# Altium schematic sheet esc_servo.SchDoc
size A4
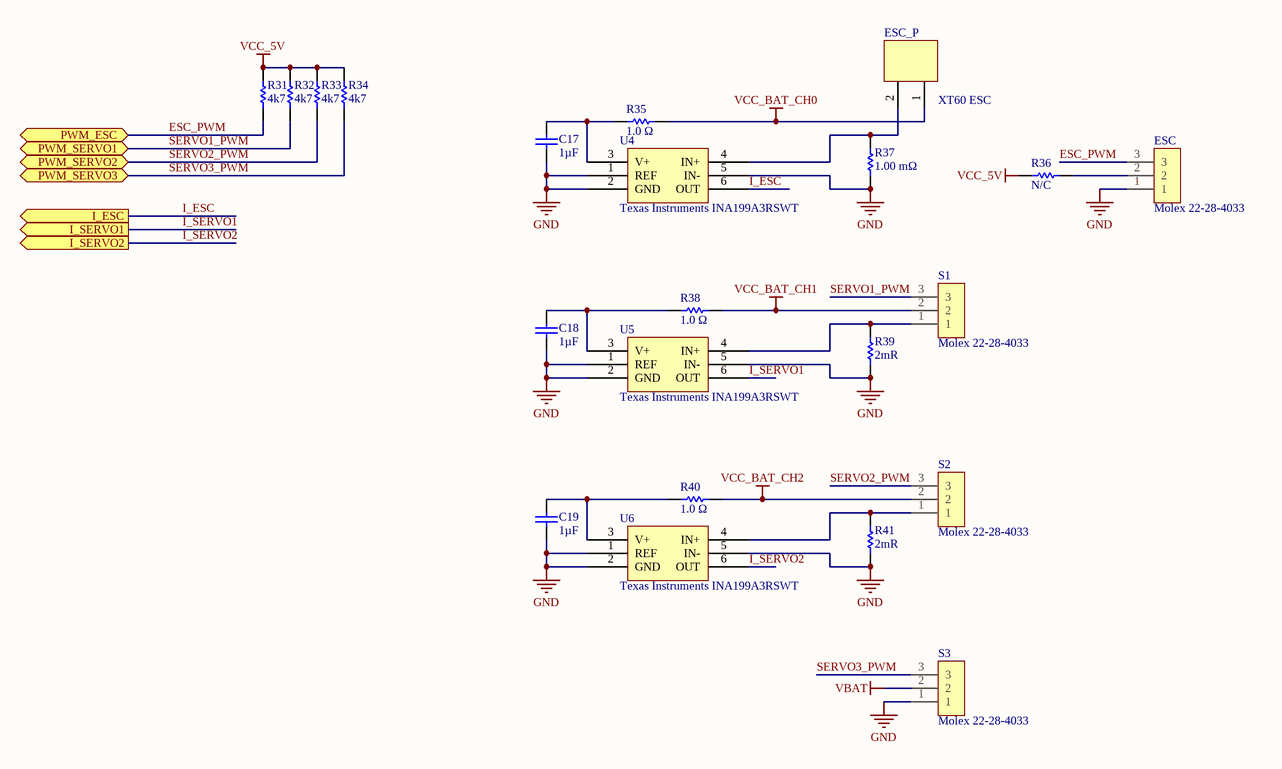
[diagram p0: esc_servo.SchDoc]

## Parts
C17  1µF  [CAPC1608X90X35LL15T15]
C18  1µF  [CAPC1608X90X35LL15T15]
C19  1µF  [CAPC1608X90X35LL15T15]
ESC  Molex 22-28-4033  [PCB-8kup8qw5vsmkearo8v0b-1]
ESC_P  XT60 ESC  [PCB-8tmbcd94dx0l5ponnqur-1]
R31  4k7  [RESC1608X55X30NL15T15]
R32  4k7  [RESC1608X55X30NL15T15]
R33  4k7  [RESC1608X55X30NL15T15]
R34  4k7  [RESC1608X55X30NL15T15]
R35  1.0 Ω  [RESC1609X50X30LL10T20]
R36  N/C  [RESC1608X55X25LL10T15]
R37  1.00 mΩ  [PCB-wws5gc0zzodyoofoa1sn-1]
R38  1.0 Ω  [RESC1609X50X30LL10T20]
R39  2mR  [RESC3216X89X51ML25T25]
R40  1.0 Ω  [RESC1609X50X30LL10T20]
R41  2mR  [RESC3216X89X51ML25T25]
S1  Molex 22-28-4033  [PCB-8kup8qw5vsmkearo8v0b-1]
S2  Molex 22-28-4033  [PCB-8kup8qw5vsmkearo8v0b-1]
S3  Molex 22-28-4033  [PCB-8kup8qw5vsmkearo8v0b-1]
U4  Texas Instruments INA199A3RSWT  [PCB-dzg43p1s5wcf61j10amz-1]
U5  Texas Instruments INA199A3RSWT  [PCB-dzg43p1s5wcf61j10amz-1]
U6  Texas Instruments INA199A3RSWT  [PCB-dzg43p1s5wcf61j10amz-1]

## Ports
I_ESC (out), I_SERVO1 (out), I_SERVO2 (out), PWM_ESC, PWM_SERVO1, PWM_SERVO2, PWM_SERVO3

## Nets
GND: C17.2 C18.2 C19.2 ESC.1 R37.1 R39.1 R41.1 S3.1 U4.1(REF) U4.2(GND) U4.5(IN-) U5.1(REF) U5.2(GND) U5.5(IN-) U6.1(REF) U6.2(GND) U6.5(IN-)
VBAT: S3.2
VCC_5V: R31.2 R32.2 R33.2 R34.2 R36.2
VCC_BAT_CH0: ESC_P.1 R35.2
VCC_BAT_CH1: R38.2 S1.2
VCC_BAT_CH2: R40.2 S2.2
ESC_PWM: ESC.3 R31.1 ; port PWM_ESC
I_ESC: U4.6(OUT) ; port I_ESC
I_SERVO1: U5.6(OUT) ; port I_SERVO1
I_SERVO2: U6.6(OUT) ; port I_SERVO2
SERVO1_PWM: R32.1 S1.3 ; port PWM_SERVO1
SERVO2_PWM: R33.1 S2.3 ; port PWM_SERVO2
SERVO3_PWM: R34.1 S3.3 ; port PWM_SERVO3
NetC17_1: C17.1 R35.1 U4.3(V+)
NetC18_1: C18.1 R38.1 U5.3(V+)
NetC19_1: C19.1 R40.1 U6.3(V+)
NetESC_2: ESC.2 R36.1
NetESC_P_2: ESC_P.2 R37.2 U4.4(IN+)
NetR39_2: R39.2 S1.1 U5.4(IN+)
NetR41_2: R41.2 S2.1 U6.4(IN+)

## Library data of the parts
C17-C19 = CMP-f2f83b8d074c2d3f-6: 0603 1 uF 16 V ±10 % Tolerance X5R SMT Multilayer Ceramic Capacitor; Capacitance Tolerance: ±10%; Lead-Free Status: Lead Free; Voltage Rating (DC): 16.0 V; Dielectric Characteristic: X5R; Mounting Style: Surface Mount; OctopartID: f2f83b8d074c2d3f
ESC S1-S3 = CMP-b995709ba24d6652-18: SERVAL TRIJUMPER; Gender: Male; Current Rating: 4.00 A; Number of Circuits: 3; Voltage Rating (DC): 250 V; Pin Pitch: 2.54 mm; Glow Wire Compliant: Non-Compliant; Number of Rows: 1; Operating Temperature: 75.0 °C (max); Halogen Free Status: Not Low Halogen; Contact Material: Phosphor Bronze; Octopart URL: https://octopart.com/22-28-4033-molex-278206; Housing Color: Black; Size-Length: 7.62 mm; Contact Plating: Gold; RoHS: Compliant; Manufacturer Part Number: 22-28-4033; OctopartID: b995709ba24d6652; Housing Material: Nylon; Mounting Style: Through Hole; Flammability Rating: UL 94 V-0; Packaging: Bulk; REACH SVHC Compliance: No SVHC; Number of Positions: 3; Orientation: Vertical; Size-Height: 2.29 mm
ESC_P = CMP-d8151592827e07d2-9: XT60 Connector Male
R31-R34 = CMP-e2bf28f8a65d3d78-11: Res Thick Film 0603 4.7K Ohm 1% 1/10W ±100ppm/°C Molded SMD Paper T/R; Mounting Style: Surface Mount
R35 R38 R40 = CMP-1856057-2: RES SMD 1 OHM 5% 1/10W 0603; Manufacturer Part Number: CRCW06031R00JNEA; Lead-Free Status: Lead Free; Power Rating: 0.1 W; Temperature Coefficient: 200.0 ppm/°C; Voltage Rating (DC): 75.0 V; Case/Package: 0603; Mounting Style: Surface Mount; Number of Pins: 2; Octopart Url: https://octopart.com/crcw06031r00jnea-vishay-39838014; OctopartID: a4176f42604f7bd0; Packaging: Cut Tape (CT); Resistance: 1.0 Ω; Resistance Tolerance: ±5%; RoHS: Compliant; Size-Height: 0.00045 m; Size-Length: 0.00155 m; Size-Width: 0.00085 m
R36 = CMP-3661350-4: Thick Film Resistors - SMD ZERO OHM JUMPER; Voltage Rating (DC): 50.0 V; Lead-Free Status: Lead Free; Resistance Tolerance: ±5%; Resistance: 0.0 Ω; Octopart Url: https://octopart.com/rc0603jr-130rl-yageo-9297262; Case/Package: 0603; OctopartID: ee3b27bc163331fc
R37 = CMP-5c9b974035f1835c-1: Res Thick Film 2512 0.001 Ohm 1% 3W ±50ppm/C Pad SMD Automotive T/R; Manufacturer Part Number: CRE2512-FZ-R001E-3; Power Rating: 3.00 W; Temperature Coefficient: -75.0 ppm/°C to 75.0 ppm/°C; Mounting Style: Solder; RoHS: Compliant; Packaging: Tape & Reel (TR), Cut Tape (CT); Resistance: 1.00 mΩ; Resistance Tolerance: ±1%; OctopartID: 5c9b974035f1835c; Octopart URL: https://octopart.com/cre2512-fz-r001e-3-bourns-47270924; REACH SVHC Compliance: No SVHC
R39 R41 = CMP-1863047-2: Res Metal Strip 1206 0.02 Ohm 1% 0.25W(1/4W) ±75ppm/C Molded SMD Automotive Embossed Plastic T/R; Manufacturer Part Number: WSL1206R0200FEA; Case/Package (SI): 3216; Lead-Free Status: Lead Free; Resistance: 0.02 Ω; Mounting Style: Surface Mount; Number of Pins: 2; Octopart Url: https://octopart.com/wsl1206r0200fea-vishay-39744192; OctopartID: 364ffd1b61e9e988; Power Rating: 0.25 W; REACH SVHC Compliance: No SVHC; Resistance Tolerance: ±1%; RoHS: Compliant; Size-Height: 0.000635 m; Size-Length: 0.0032004 m; Size-Width: 0.0016002 m
U4-U6 = CMP-0f05c77d0cddd0c2-11: 26-V, Bi-Directional, Zero-Drift, Low- or High-Side, Voltage Output Current Shunt Monitor 6-SC70 -40 to 125; Lead-Free Status: Lead Free; Mounting Style: Surface Mount; RoHS: Compliant; Octopart URL: http://octopart.com/ina199b3dckr-texas+instruments-24258238; OctopartID: 0f05c77d0cddd0c2